# Altium schematic sheet PSU.SchDoc
size A4
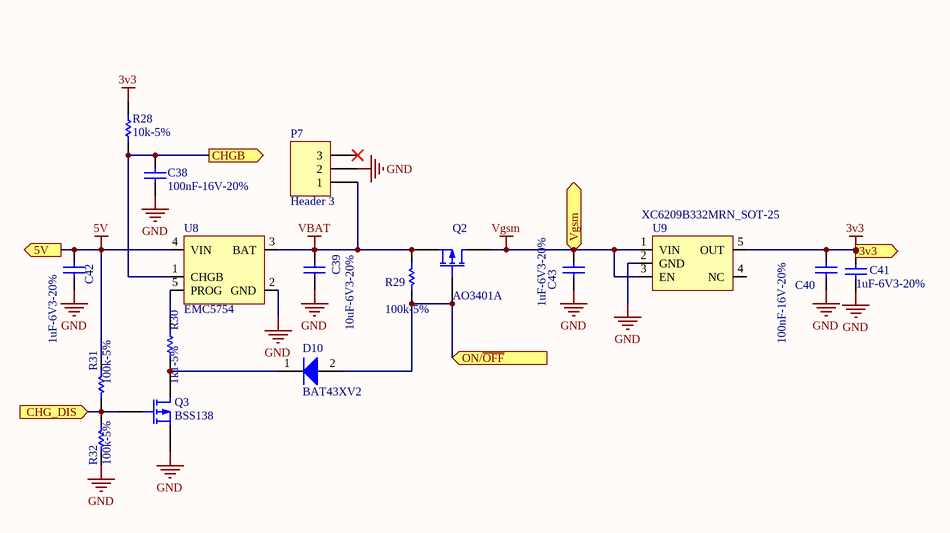
[diagram p0: PSU.SchDoc]

## Parts
C38  100nF-16V-20%  [C0402]
C39  10uF-6V3-20%  [C0402]
C40  100nF-16V-20%  [C0402]
C41  1uF-6V3-20%  [C0402]
C42  1uF-6V3-20%  [C0402]
C43  1uF-6V3-20%  [C0402]
D10  BAT43XV2  [SOD-523F]
P7  Header 3  [BAT_CON]
Q2  AO3401A  [SOT23-3]
Q3  BSS138  [SOT23-3]
R28  10k-5%  [R0402]
R29  100k-5%  [R0402]
R30  1k1-5%  [R0402]
R31  100k-5%  [R0402]
R32  100k-5%  [R0402]
U8  EMC5754  [SOT23-5]
U9  XC6209B332MRN_SOT-25  [SOT23-5]

## Ports
3v3 (out), 5V (out), CHG_DIS (in), CHGB (out), ON/~{OFF} (in), Vgsm (out)

## Nets
3v3: C40.2 C41.1 R28.2 U9.5(OUT) ; port 3v3
5V: C42.2 R31.2 U8.4(VIN) ; port 5V
GND: C38.1 C39.1 C40.1 C41.2 C42.1 C43.2 P7.2 Q3.2(S) R32.1 U8.2(GND) U9.2(GND)
VBAT: C39.2 P7.1 Q2.2(S) R29.2 U8.3(BAT)
Vgsm: C43.1 Q2.3(D) U9.1(VIN) U9.3(EN)
CHG_DIS: Q3.1(G) R31.1 R32.2 ; port CHG_DIS
CHGB: C38.2 R28.1 U8.1(CHGB) ; port CHGB
ON/~{OFF}: D10.2(A) Q2.1(G) R29.1 ; port ON/~{OFF}
NetD10_1: D10.1(K) Q3.3(D) R30.2
NetR30_1: R30.1 U8.5(PROG)

Not connected (* = marked no-connect by the designer): P7 3*; U9 4(NC)

## Library data of the parts
C38 C40 = Cap: CAP CER 0.1UF 16V Y5V 0402; Manufacturer: Yageo; Manufacturer Part Number: CC0402ZRY5V7BB104; Published: 8-Jun-2000; LatestRevisionDate: 17-Jul-2002; LatestRevisionNote: Re-released for DXP Platform.; PackageReference: C0402; Publisher: Altium Limited; Value: 100nF-16V-20%; Digi-Key Part Number: 311-1047-1-ND; Unit Price: 0.00250
C39 = Cap: CAP CER 10UF 6.3V 20% X5R 0603; Manufacturer: Yageo; Manufacturer Part Number: CC0603MRX5R5BB106; Published: 8-Jun-2000; LatestRevisionDate: 17-Jul-2002; LatestRevisionNote: Re-released for DXP Platform.; PackageReference: C0603; Publisher: Altium Limited; Value: 10uF-6V3-20%; Digi-Key Part Number: 311-1448-1-ND; Unit Price: 0.06176
C41-C43 = Cap: CAP CER 1UF 6.3V Y5V 0402; Manufacturer: Yageo; Manufacturer Part Number: CC0402ZRY5V5BB105; Published: 8-Jun-2000; LatestRevisionDate: 17-Jul-2002; LatestRevisionNote: Re-released for DXP Platform.; PackageReference: C0402; Publisher: Altium Limited; Value: 1uF-6V3-20%; Digi-Key Part Number: 311-1377-2-ND; Unit Price: 0.00465
D10 = Diode: Diode Type SMD; Manufacturer: Fairchild Semiconductor; Published: 8-Jun-2000; LatestRevisionDate: 17-Jul-2002; LatestRevisionNote: Re-released for DXP Platform.; PackageVersion: Sep-1996; PackageReference: SMC; Publisher: Altium Limited; Code_JEDEC: DO-214-AB; Value: BAT43XV2; Digi-Key Part Number: BAT43XV2CT-ND; Manufacturer Part Number: BAT43XV2; Unit Price: 0.01822
P7 = Header 3: Header, 3-Pin; LatestRevisionDate: 17-Jul-2002; LatestRevisionNote: Re-released for DXP Platform.; Publisher: Altium Limited
Q2 = MOSFET-P: MOSFET P-CH -30V -4.3A SOT23; Manufacturer: Alpha & Omega Semiconductor Inc; Remark: NA; Published: 8-Jun-2000; LatestRevisionDate: 17-Jul-2002; LatestRevisionNote: Re-released for DXP Platform.; PackageVersion: 1995/1996; PackageReference: E3; Publisher: Altium Limited; Digi-Key Part Number: 785-1001-1-ND; Manufacturer Part Number: AO3401A; Unit Price: 0.12400
Q3 = MOSFET-P: MOSFET N-CH 50V 200MA SOT23-3; Manufacturer: Diodes Inc; Manufacturer Part Number: BSS138-7-F; Published: 8-Jun-2000; LatestRevisionDate: 17-Jul-2002; LatestRevisionNote: Re-released for DXP Platform.; PackageVersion: 1995/1996; PackageReference: E3; Publisher: Altium Limited; Digi-Key Part Number: BSS138-FDICT-ND; Unit Price: 0.06575
R28 = Res1: RES 10K OHM 1/16W 5% 0402 SMD; Manufacturer: Yageo; Manufacturer Part Number: RC0402JR-0710KL; Description: RES 10K OHM 1/10W 5% 0603 SMD; Published: 8-Jun-2000; LatestRevisionDate: 17-Jul-2002; LatestRevisionNote: Re-released for DXP Platform.; PackageReference: R0603; Publisher: Altium Limited; Value: 10k-5%; Digi-Key Part Number: 311-10KJRCT-ND; Unit Price: 0.00178
R29 R31 R32 = Res1: RES 100K OHM 1/16W 5% 0402 SMD; Manufacturer: Yageo; Manufacturer Part Number: RC0402JR-07100KL; Published: 8-Jun-2000; LatestRevisionDate: 17-Jul-2002; LatestRevisionNote: Re-released for DXP Platform.; PackageReference: R0402; Publisher: Altium Limited; Value: 100k-5%; Digi-Key Part Number: 311-100KJRCT-ND; Unit Price: 0.00171
R30 = Res1: RES 1.1K OHM 1/16W 5% 0402 SMD; Manufacturer: Yageo; Manufacturer Part Number: RC0402JR-071K1L; Published: 8-Jun-2000; LatestRevisionDate: 17-Jul-2002; LatestRevisionNote: Re-released for DXP Platform.; PackageReference: R0603; Publisher: Altium Limited; Value: 1k1-5%; Digi-Key Part Number: 311-1.1KJRCT-ND; Unit Price: 0.00207
U9 = XC6209B332MRN_SOT-25: Manufacturer: Tyrone